# EAGLE design Fonte (EAGLE 9.6.2)
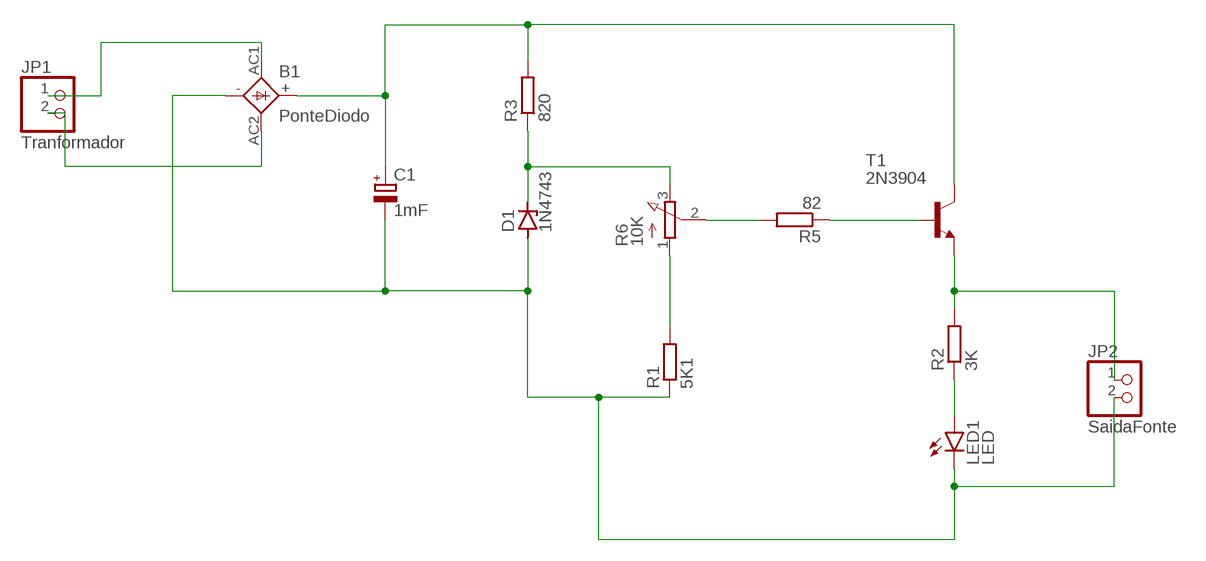
[diagram p0: schematic, sheet 1]

## Parts
B1  PonteDiodo  1KAB  [1KAB]
C1  1mF  CPOL-EUE5-10.5  [E5-10,5]
D1  1N4743  1N4728  [DO41Z10]
JP1  Tranformador  PINHD-1X2  [1X02]
JP2  SaidaFonte  PINHD-1X2  [1X02]
LED1  LED  LED5MM  [LED5MM]
R1  5K1  R-EU_0204/7  [0204/7]
R2  3K  R-EU_0204/7  [0204/7]
R3  820  R-EU_0204/7  [0204/7]
R5  82  R-EU_0204/7  [0204/7]
R6  10K  3RP/1610N  [3RP/1610N]
T1  2N3904  [TO92]

## Nets
N$1: B1.AC1 JP1.1
N$2: B1.AC2 JP1.2
N$3: B1.+ C1.+ R3.2 T1.1(C)
N$4: B1.- C1.- D1.A JP2.2 LED1.K(C) R1.1
N$5: D1.C R3.1 R6.3(E)
N$6: R1.2 R6.1(A)
N$7: R5.2 R6.2(S)
N$8: R5.1 T1.2(B)
N$9: JP2.1 R2.2 T1.3(E)
N$10: LED1.A R2.1

## Library data of the parts
B1 = rectifier:1KAB: RECTIFIER grid 5,08 x 5,08 mm
C1 = rcl:CPOL-EU: POLARIZED CAPACITOR, European symbol; SPICEPREFIX: C
D1 = diode:1N4728: Z DIODE 3.3 V, 1W, 5 percent
JP1 JP2 = pinhead:PINHD-1X2: PIN HEADER
LED1 = led:LED: LED OSRAM: - CHIPLED LG R971, LG N971, LY N971, LG Q971, LY Q971, LO R971, LY R971 LH N974, LH R974 LS Q976, LO Q976, LY Q976 LO Q996 - Hyper CHIPLED LW Q18S LB Q993, LB Q99A, LB R99A - SideLED LS A670, LO A670, LY A670, LG A670, LP A670 LB A673, LV A673, LT A673, LW A673 LH A674 LY A675 LS A676, LA A676, LO A676, LY A676, LW A676 LS A679, LY A679, LG A679 - Hyper Micro SIDELED® LS Y876, LA Y876, LO Y876, LY Y876 LT Y87S - SmartLED LW L88C, LW L88S LB L89C, LB L89S, LG L890 LS L89K, LO L89K, LY L89K LS L896, LA L896, LO L896, LY L896 - TOPLED LS T670, LO T670, LY T670, LG T670, LP T670 LSG T670, LSP T670, LSY T670, LOP T670, LYG T670 LG T671, LOG T671, LSG T671 LB T673, LV T673, LT T673, LW T673 LH T674 LS T676, LA T676, LO T676, LY T676, LB T676, LH T676, LSB T676, LW T676 LB T67C, LV T67C, LT T67C, LS T67K, LO T67K, LY T67K, LW E67C LS E67B, LA E67B, LO E67B, LY E67B, LB E67C, LV E67C, LT E67C LW T67C LS T679, LY T679, LG T679 LS T770, LO T770, LY T770, LG T770, LP T770 LB T773, LV T773, LT T773, LW T773 LH T774 LS E675, LA E675, LY E675, LS T675 LS T776, LA T776, LO T776, LY T776, LB T776 LHGB T686 LT T68C, LB T68C - Hyper Mini TOPLED® LB M676 - Mini TOPLED Santana® LG M470 LS M47K, LO M47K, LY M47K Source: http://www.osram.convergy.de LUXEON: - LUMILED® LXK2-PW12-R00, LXK2-PW12-S00, LXK2-PW14-U00, LXK2-PW14-V00 LXK2-PM12-R00, LXK2-PM12-S00, LXK2-PM14-U00 LXK2-PE12-Q00, LXK2-PE12-R00, LXK2-PE12-S00, LXK2-PE14-T00, LXK2-PE14-U00 LXK2-PB12-K00, LXK2-PB12-L00, LXK2-PB12-M00, LXK2-PB14-N00, LXK2-PB14-P00, LXK2-PB14-Q00 LXK2-PR12-L00, LXK2-PR12-M00, LXK2-PR14-Q00, LXK2-PR14-R00 LXK2-PD12-Q00, LXK2-PD12-R00, LXK2-PD12-S00 LXK2-PH12-R00, LXK2-PH12-S00 LXK2-PL12-P00, LXK2-PL12-Q00, LXK2-PL12-R00 Source: www.luxeon.com KINGBRIGHT: KA-3528ASYC Source: www.kingbright.com
R1-R3 R5 = rcl:R-EU_: RESISTOR, European symbol; SPICEPREFIX: R
R6 = pot:3RP/1610N: 16mm Potentiometer one level Source: http://www.alphapotentiometers.net/html/16mm_pot_2.html
T1 = transistor:2N3904: NPN TRANSISTOR

## Board
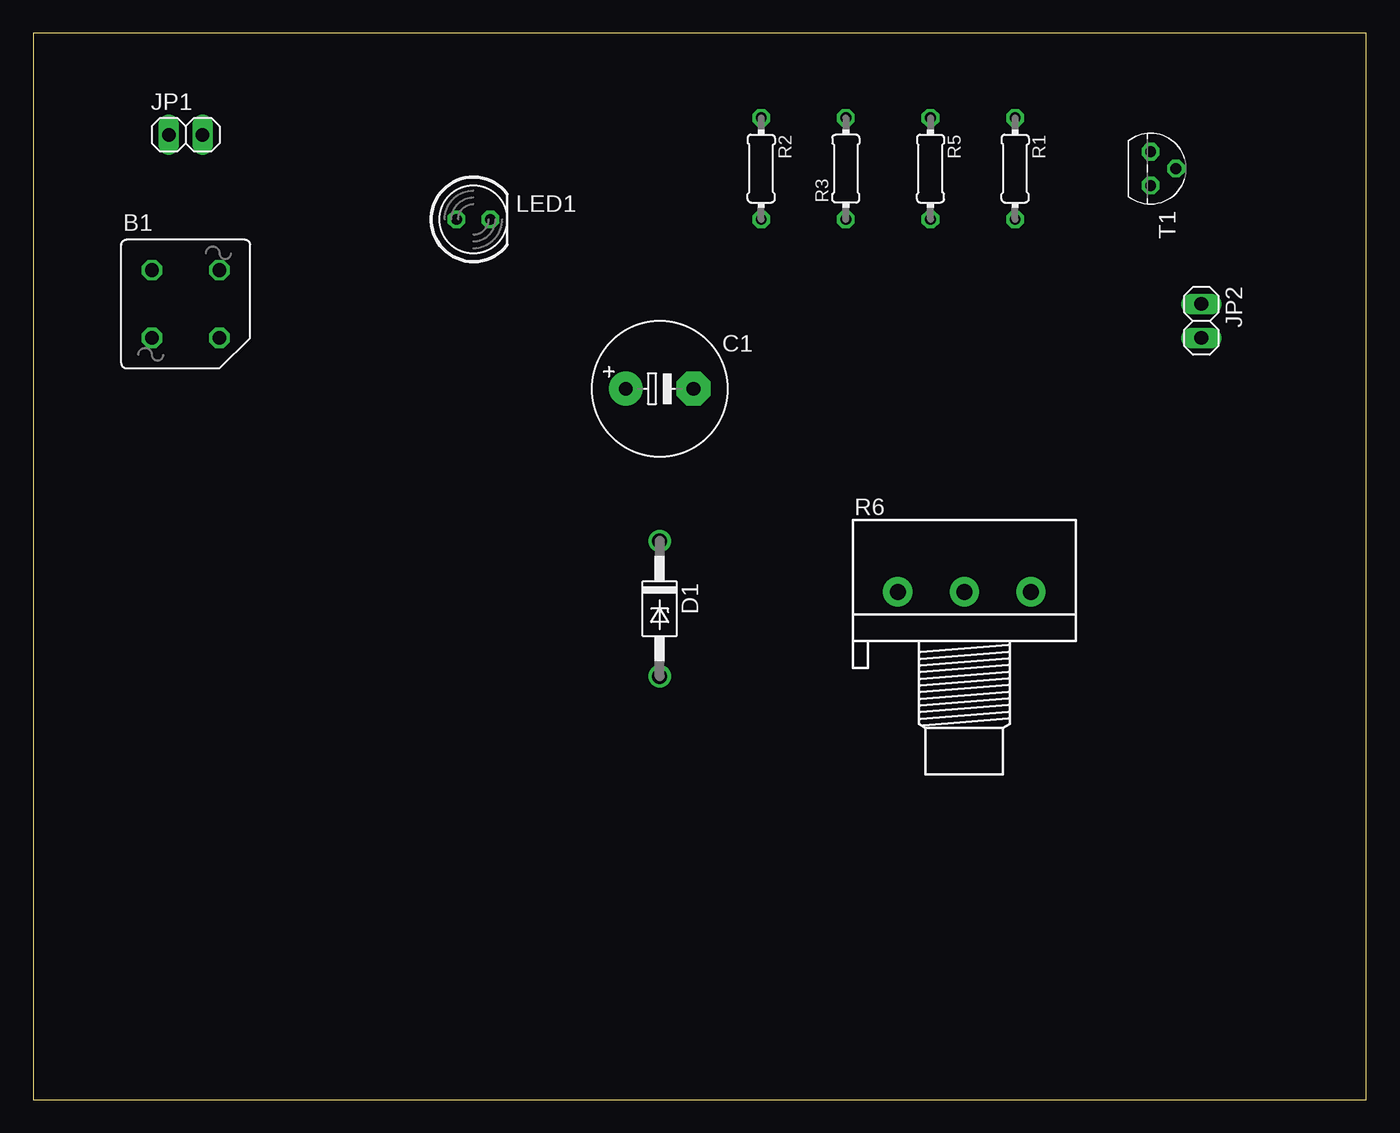
[diagram p1: board, top side]
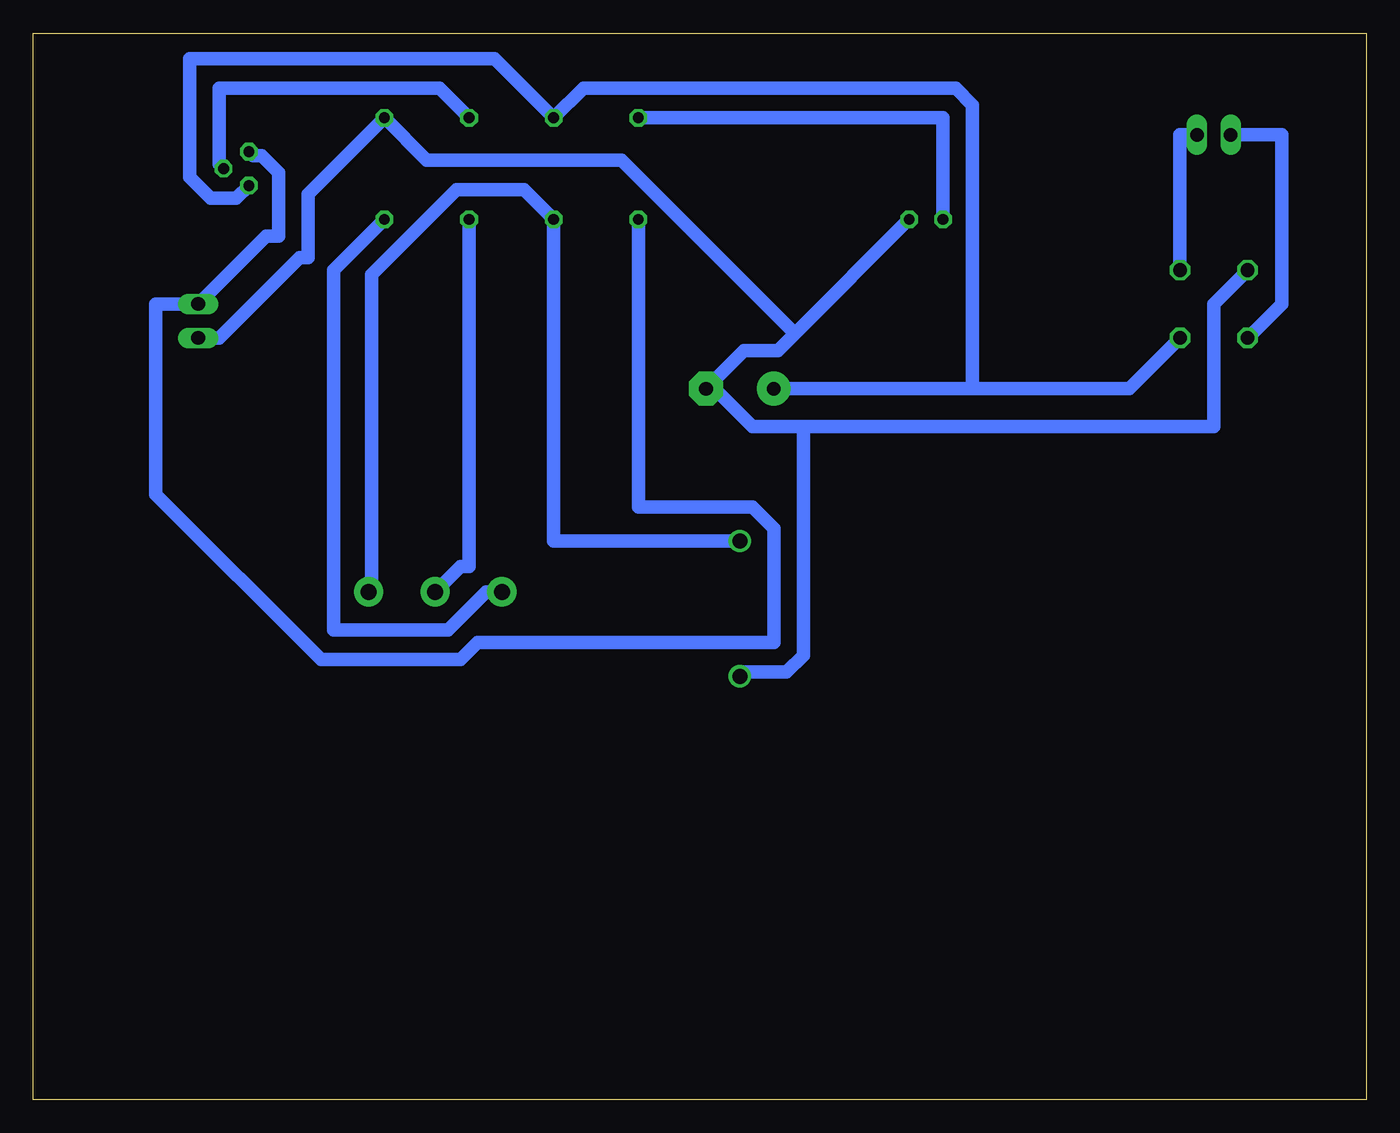
[diagram p2: board, bottom side, seen from below]

Size 100 x 80 mm. Coordinates in mm from the lower left corner, seen from the top.
Outline: 0,0 100,0 100,80 0,80 0,0
Copper layers (1*16): Top 0.035mm / dielectric 1.5mm / Bottom 0.035mm
Design rules "default *": minimum track width 40mil, minimum drill 0.35mm, track to track 40mil, track to pad 40mil, pad to pad 40mil, via to via 40mil, smd to smd 6mil, copper to edge 40mil, drill to drill 6mil, minimum pad ring 10mil, minimum via ring 8mil, stop-mask expansion 4mil, vias tented up to drill 0mil, thermal gap 10mil

### Footprints (pad centres in the part's own frame; a part is rotated, then mirrored left to right if it is on the bottom)
1KAB = drill 1.016 octagon: + 2.54,-2.54; - -2.54,2.54; AC1 -2.54,-2.54; AC2 2.54,2.54
E5-10,5 = drill 1.016 pad 2.54: + -2.54,0 | drill 1.016 pad 2.54 octagon: - 2.54,0
DO41Z10 = drill 1.118: A 5.08,0; C -5.08,0
1X02 = drill 1.016 long: 1 -1.27,0; 2 1.27,0
LED5MM = drill 0.813 octagon: A -1.27,0; K 1.27,0
0204/7 = drill 0.813 octagon: 1 -3.81,0; 2 3.81,0
3RP/1610N = drill 1.2 pad 2.184: 1 -5,0; 2 0,0; 3 5,0
TO92 = drill 0.813 octagon: 1 1.27,0; 2 0,1.905; 3 -1.27,0

### Placement (x,y rotation side)
B1  11.43,59.69 0 top
C1  46.99,53.34 0 top
D1  46.99,36.83 270 top
JP1  11.43,72.39 0 top
JP2  87.63,58.42 270 top
LED1  33.02,66.04 0 top
R1  73.66,69.85 270 top
R2  54.61,69.85 270 top
R3  60.96,69.85 90 top
R5  67.31,69.85 270 top
R6  69.85,38.1 0 top
T1  83.82,69.85 270 top

### Tracks (layer width: path | path; a pad name or v marks a point on that pad's centre or on a via)
N$1
  Bottom 1.016: B1.AC1 6.35,59.69 6.35,72.39 JP1.1
N$2
  Bottom 1.016: B1.AC2 13.97,72.39 JP1.2
N$3
  Bottom 1.016: T1.1 84.77,67.63 86.68,67.63 88.27,69.22 88.27,78.11 65.41,78.11 R3.2 58.74,75.88 30.8,75.88 29.53,74.61 29.53,53.34 | B1.+ 17.78,53.34 29.53,53.34 | C1.+ 29.53,53.34
N$4
  Bottom 1.016: JP2.2 86.04,57.15 80.01,63.18 79.38,63.18 79.38,67.94 R1.1 70.48,70.48 55.88,70.48 42.86,57.47 | 42.86,57.47 44.13,56.2 46.67,56.2 C1.- 48.9,53.34 46.04,50.48 42.23,50.48 | 42.86,57.47 LED1.K | B1.- 11.43,59.69 11.43,50.48 42.23,50.48 | D1.A 46.67,32.07 43.5,32.07 42.23,33.34 42.23,50.48
N$5
  Bottom 1.016: D1.C 60.96,41.91 R3.1 63.18,68.26 68.26,68.26 74.61,61.91 74.61,38.1 R6.3
N$6
  Bottom 1.016: R1.2 77.47,62.23 77.47,35.24 68.9,35.24 66.04,38.1 R6.1
N$7
  Bottom 1.016: R5.2 67.31,40.01 67.94,40.01 R6.2
N$8
  Bottom 1.016: T1.2 86.04,70.17 86.04,75.88 69.53,75.88 R5.1
N$9
  Bottom 1.016: R2.2 54.61,44.45 46.04,44.45 44.45,42.86 44.45,34.29 66.67,34.29 67.94,33.02 78.42,33.02 90.81,45.4 90.81,59.69 JP2.1 82.55,64.77 81.6,64.77 81.6,69.53 82.87,70.8 83.5,70.8 T1.3
N$10
  Bottom 1.016: LED1.A 31.75,73.66 R2.1